# EasyEDA schematic Schematic_TiN.json
TITLE: TiN; REV: 2.0; Date: 2021-08-31; Sheet: 1/1; Drawn By: Andrzej Deja; Company: AGH
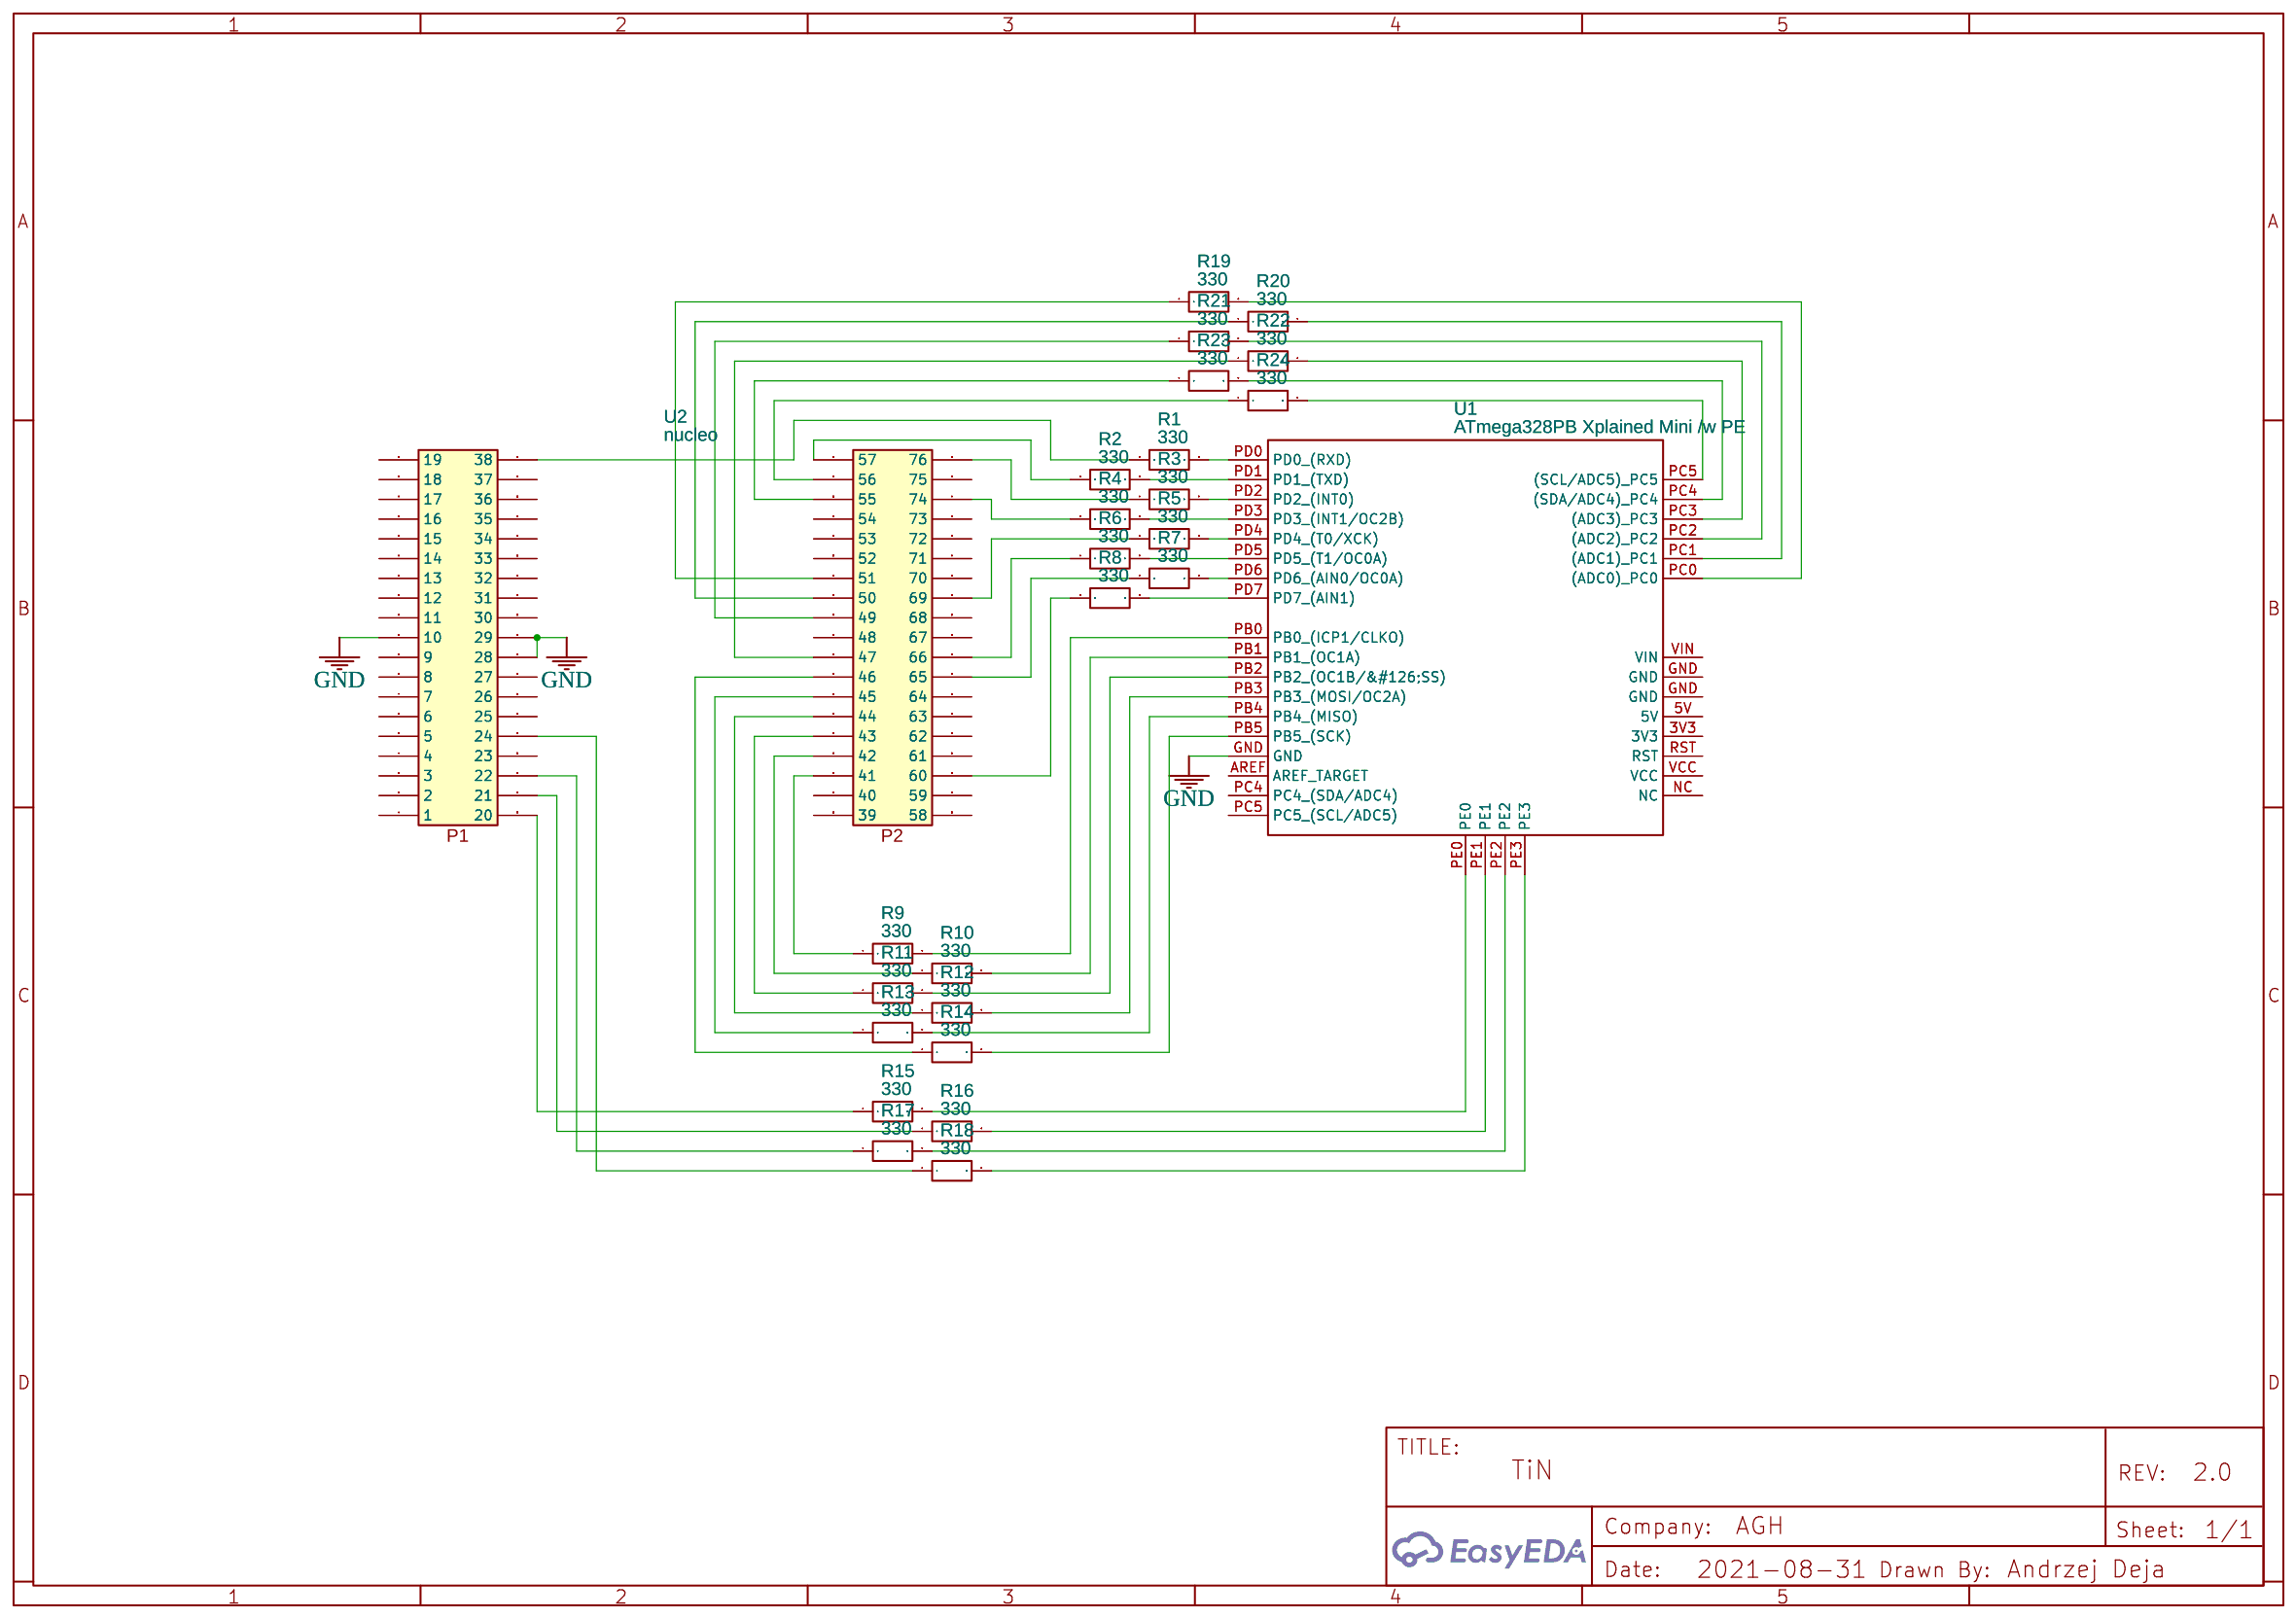
[diagram p0: schematic sheet]

## Parts
R1  330  [R0805]
R2  330  [R0805]
R3  330  [R0805]
R4  330  [R0805]
R5  330  [R0805]
R6  330  [R0805]
R7  330  [R0805]
R8  330  [R0805]
R9  330  [R0805]
R10  330  [R0805]
R11  330  [R0805]
R12  330  [R0805]
R13  330  [R0805]
R14  330  [R0805]
R15  330  [R0805]
R16  330  [R0805]
R17  330  [R0805]
R18  330  [R0805]
R19  330  [R0805]
R20  330  [R0805]
R21  330  [R0805]
R22  330  [R0805]
R23  330  [R0805]
R24  330  [R0805]
U1  ATmega328PB Xplained Mini /w PE  [ATMEGA328PB XPLAINED]
U2  nucleo  [NUCLEO]

## Library data of the parts
R1-R24 = R_0805_EU: Contributor: LCEDA_Lib
U1 = ATmega328PB Xplained Mini /w PE: Contributor: aracoin; Manufacturer: Atmel
U2 = nucleo: Contributor: 574919105

## Nets
GND: U1.GND U2.10 U2.28 U2.29
Net-(R1-1): R1.1 U2.38
Net-(R1-2): R1.2 U1.PD0(PD0 (RXD))
Net-(R2-1): R2.1 U2.57
Net-(R2-2): R2.2 U1.PD1(PD1 (TXD))
Net-(R3-1): R3.1 U2.76
Net-(R3-2): R3.2 U1.PD2(PD2 (INT0))
Net-(R4-1): R4.1 U2.74
Net-(R4-2): R4.2 U1.PD3(PD3 (INT1/OC2B))
Net-(R5-1): R5.1 U2.69
Net-(R5-2): R5.2 U1.PD4(PD4 (T0/XCK))
Net-(R6-1): R6.1 U2.66
Net-(R6-2): R6.2 U1.PD5(PD5 (T1/OC0A))
Net-(R7-1): R7.1 U2.65
Net-(R7-2): R7.2 U1.PD6(PD6 (AIN0/OC0A))
Net-(R8-1): R8.1 U2.60
Net-(R8-2): R8.2 U1.PD7(PD7 (AIN1))
Net-(R9-1): R9.1 U2.41
Net-(R9-2): R9.2 U1.PB0(PB0 (ICP1/CLKO))
Net-(R10-1): R10.1 U2.42
Net-(R10-2): R10.2 U1.PB1(PB1 (OC1A))
Net-(R11-1): R11.1 U2.43
Net-(R11-2): R11.2 U1.PB2(PB2 (OC1B/&#126;SS))
Net-(R12-1): R12.1 U2.44
Net-(R12-2): R12.2 U1.PB3(PB3 (MOSI/OC2A))
Net-(R13-1): R13.1 U2.45
Net-(R13-2): R13.2 U1.PB4(PB4 (MISO))
Net-(R14-1): R14.1 U2.46
Net-(R14-2): R14.2 U1.PB5(PB5 (SCK))
Net-(R15-1): R15.1 U2.20
Net-(R15-2): R15.2 U1.PE0
Net-(R16-1): R16.1 U2.21
Net-(R16-2): R16.2 U1.PE1
Net-(R17-1): R17.1 U2.22
Net-(R17-2): R17.2 U1.PE2
Net-(R18-1): R18.1 U2.24
Net-(R18-2): R18.2 U1.PE3
Net-(R19-1): R19.1 U2.51
Net-(R19-2): R19.2 U1.PC0((ADC0) PC0)
Net-(R20-1): R20.1 U2.50
Net-(R20-2): R20.2 U1.PC1((ADC1) PC1)
Net-(R21-1): R21.1 U2.49
Net-(R21-2): R21.2 U1.PC2((ADC2) PC2)
Net-(R22-1): R22.1 U2.47
Net-(R22-2): R22.2 U1.PC3((ADC3) PC3)
Net-(R23-1): R23.1 U2.55
Net-(R23-2): R23.2 U1.PC4(PC4 (SDA/ADC4))
Net-(R24-1): R24.1 U2.56
Net-(R24-2): R24.2 U1.PC5(PC5 (SCL/ADC5))

Not connected (* = marked no-connect by the designer): U1 3V3 5V AREF(AREF_TARGET) NC RST VCC VIN; U2 1 2 3 4 5 6 7 8 9 11 12 13 14 15 16 17 18 19 23 25 26 27 30 31 32 33 34 35 36 37 39 40 48 52 53 54 58 59 61 62 63 64 67 68 70 71 72 73 75
